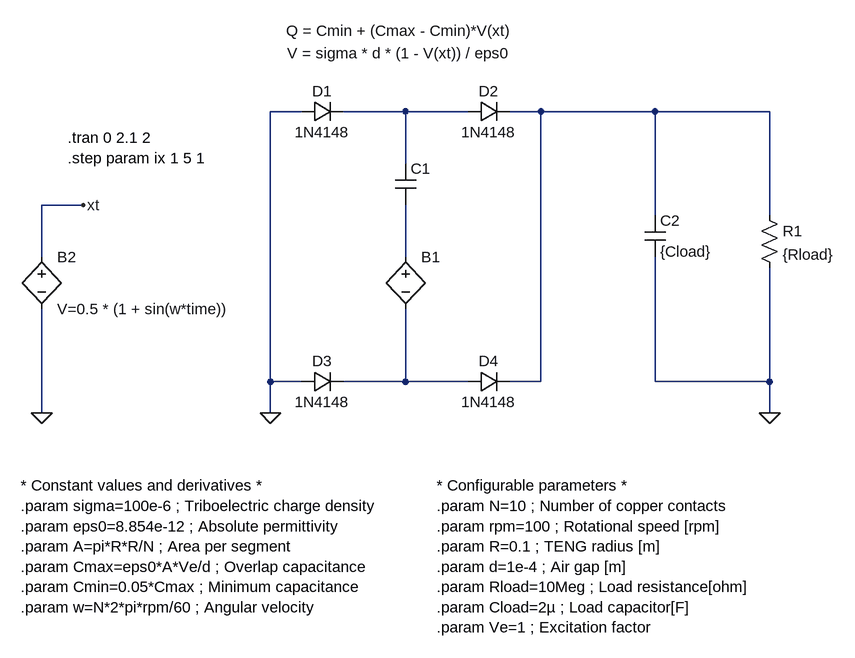
[diagram p0: schematic FSS_TENG.asc]
FSS_TENG.asc, the LTspice schematic file:
Version 4.1
SHEET 1 1740 1004
WIRE -112 -64 -160 -64
WIRE 48 -64 -48 -64
WIRE 144 -64 48 -64
WIRE 256 -64 208 -64
WIRE 432 -64 256 -64
WIRE 608 -64 432 -64
WIRE 48 16 48 -64
WIRE -448 80 -512 80
WIRE 432 96 432 -64
WIRE 608 96 608 -64
WIRE -512 160 -512 80
WIRE 48 160 48 80
WIRE -160 352 -160 -64
WIRE -112 352 -160 352
WIRE 48 352 48 240
WIRE 48 352 -48 352
WIRE 144 352 48 352
WIRE 256 352 256 -64
WIRE 256 352 208 352
WIRE 432 352 432 160
WIRE 608 352 608 176
WIRE 608 352 432 352
WIRE -512 400 -512 240
WIRE -160 400 -160 352
WIRE 608 400 608 352
FLAG -160 400 0
FLAG 608 400 0
FLAG -448 80 xt
FLAG -512 400 0
SYMBOL bv 48 144 R0
WINDOW 3 -182 -298 Left 2
SYMATTR Value V = sigma * d * (1 - V(xt)) / eps0
SYMATTR InstName B1
SYMBOL cap 32 16 R0
WINDOW 3 -168 -204 Left 2
SYMATTR Value Q = Cmin + (Cmax - Cmin)*V(xt)
SYMATTR InstName C1
SYMBOL diode -112 -48 R270
WINDOW 0 32 32 VTop 2
WINDOW 3 0 32 VBottom 2
SYMATTR InstName D1
SYMATTR Value 1N4148
SYMBOL diode 144 -48 R270
WINDOW 0 32 32 VTop 2
WINDOW 3 0 32 VBottom 2
SYMATTR InstName D2
SYMATTR Value 1N4148
SYMBOL diode -112 368 R270
WINDOW 0 32 32 VTop 2
WINDOW 3 0 32 VBottom 2
SYMATTR InstName D3
SYMATTR Value 1N4148
SYMBOL diode 144 368 R270
WINDOW 0 32 32 VTop 2
WINDOW 3 0 32 VBottom 2
SYMATTR InstName D4
SYMATTR Value 1N4148
SYMBOL cap 416 96 R0
SYMATTR InstName C2
SYMATTR Value {Cload}
SYMBOL res 592 80 R0
SYMATTR InstName R1
SYMATTR Value {Rload}
SYMBOL bv -512 144 R0
SYMATTR InstName B2
SYMATTR Value V=0.5 * (1 + sin(w*time))
TEXT -472 -24 Left 2 !.tran 0 2.1 2
TEXT -544 512 Left 2 !* Constant values and derivatives *\n.param sigma=100e-6 ; Triboelectric charge density\n.param eps0=8.854e-12 ; Absolute permittivity\n.param A=pi*R*R/N ; Area per segment\n.param Cmax=eps0*A*Ve/d ; Overlap capacitance\n.param Cmin=0.05*Cmax ; Minimum capacitance\n.param w=N*2*pi*rpm/60 ; Angular velocity
TEXT 96 512 Left 2 !* Configurable parameters *\n.param N=10 ; Number of copper contacts\n.param rpm=100 ; Rotational speed [rpm]\n.param R=0.1 ; TENG radius [m]\n.param d=1e-4 ; Air gap [m]\n.param Rload=10Meg ; Load resistance[ohm]\n.param Cload=2µ ; Load capacitor[F]\n.param Ve=1 ; Excitation factor
TEXT -472 8 Left 2 !.step param ix 1 5 1

The netlist it stands for:
* FSS_TENG.asc
B1 N003 N004 V = sigma * d * (1 - V(xt)) / eps0
C1 N001 N003 Q = Cmin + (Cmax - Cmin)*V(xt)
D1 0 N001 1N4148
D2 N001 N002 1N4148
D3 0 N004 1N4148
D4 N004 N002 1N4148
C2 N002 0 {Cload}
R1 N002 0 {Rload}
B2 xt 0 V=0.5 * (1 + sin(w*time))
.model D D
.lib standard.dio
.tran 0 2.1 2
* Constant values and derivatives *
.param sigma=100e-6 ; Triboelectric charge density
.param eps0=8.854e-12 ; Absolute permittivity
.param A=pi*R*R/N ; Area per segment
.param Cmax=eps0*A*Ve/d ; Overlap capacitance
.param Cmin=0.05*Cmax ; Minimum capacitance
.param w=N*2*pi*rpm/60 ; Angular velocity
* Configurable parameters *
.param N=10 ; Number of copper contacts
.param rpm=100 ; Rotational speed [rpm]
.param R=0.1 ; TENG radius [m]
.param d=1e-4 ; Air gap [m]
.param Rload=10Meg ; Load resistance[ohm]
.param Cload=2µ ; Load capacitor[F]
.param Ve=1 ; Excitation factor
.step param ix 1 5 1
.backanno
.end